# EAGLE design Temp Sensor - Photon Board (EAGLE 7.3.0)
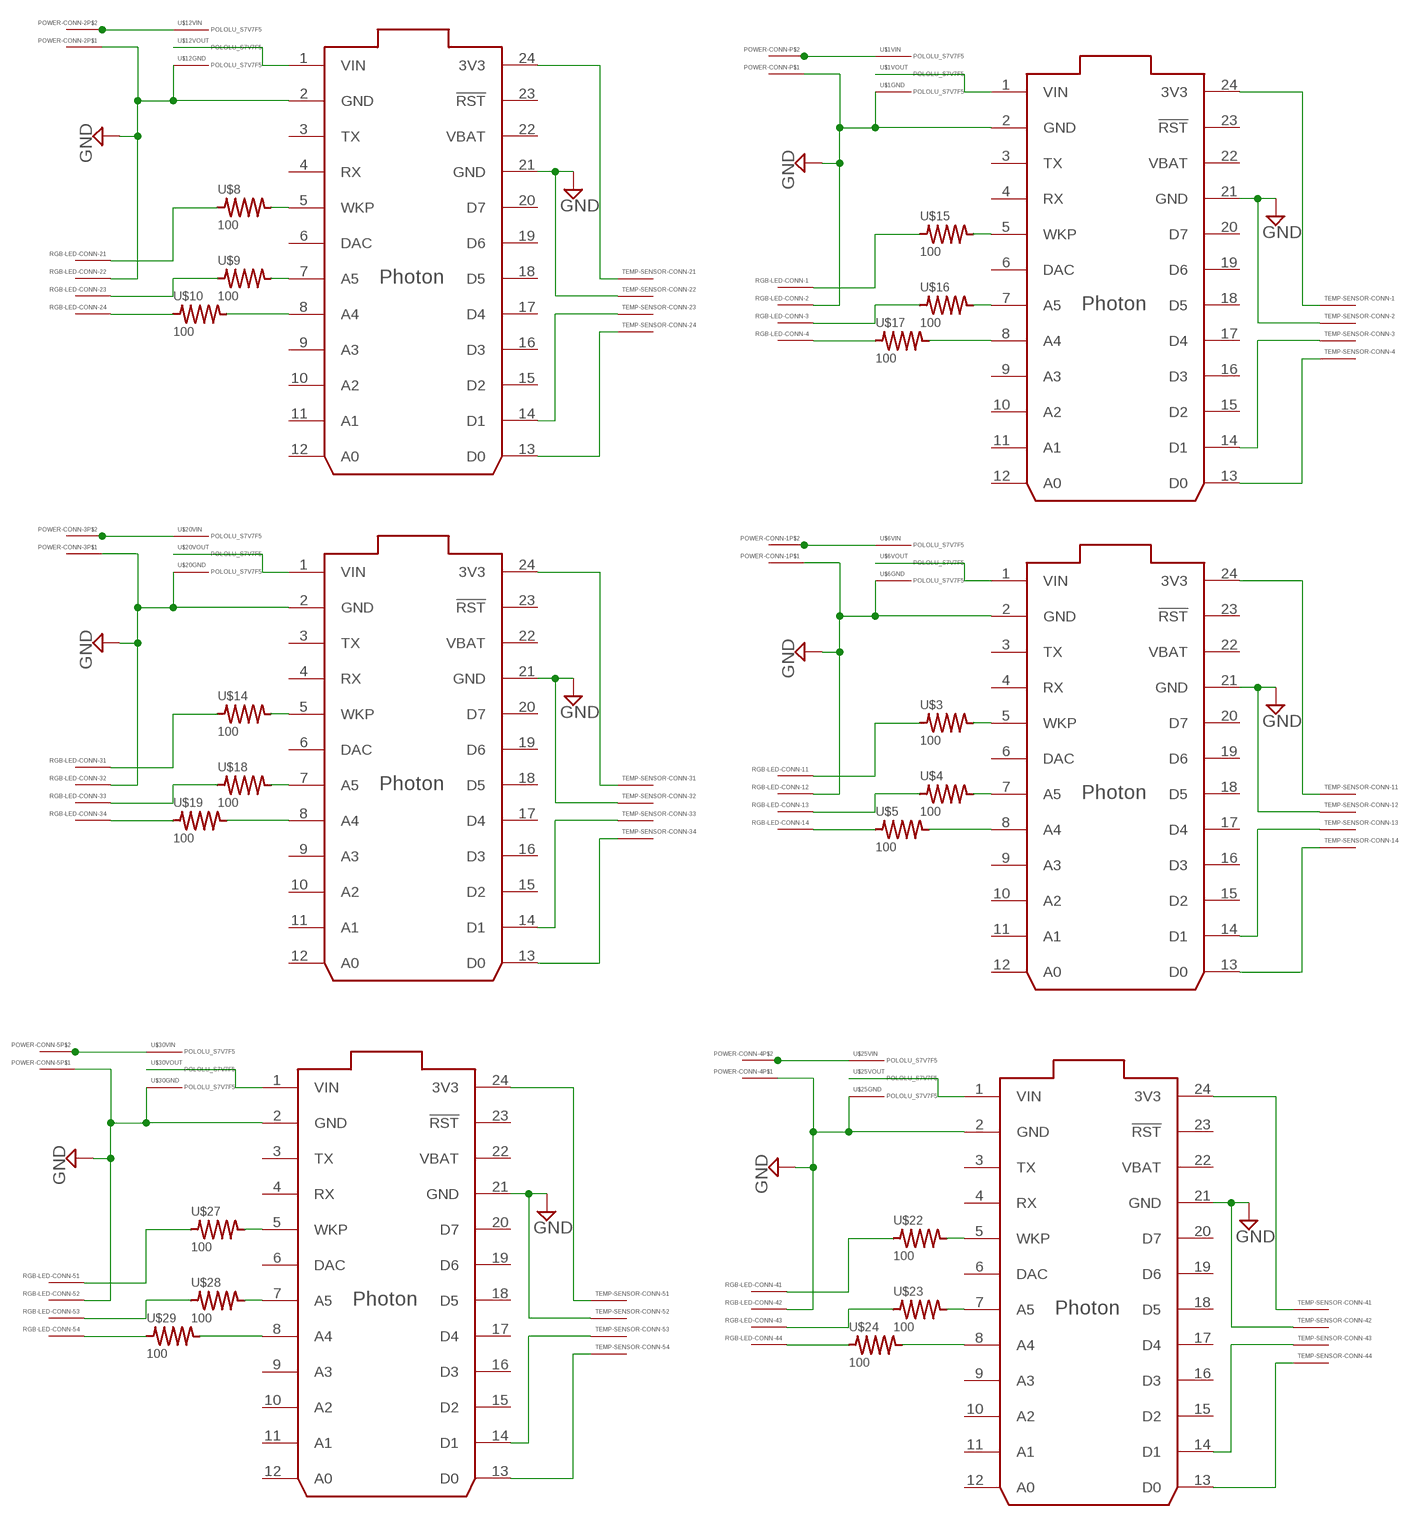
[diagram p0: schematic, sheet 1]

## Parts
POWER-CONN-  S2B-PH-K-S  [JST_PH-2]
POWER-CONN-1  S2B-PH-K-S  [JST_PH-2]
POWER-CONN-2  S2B-PH-K-S  [JST_PH-2]
POWER-CONN-3  S2B-PH-K-S  [JST_PH-2]
POWER-CONN-4  S2B-PH-K-S  [JST_PH-2]
POWER-CONN-5  S2B-PH-K-S  [JST_PH-2]
RGB-LED-CONN-  S4B-PH-K-S  [JST_PH-4]
RGB-LED-CONN-1  S4B-PH-K-S  [JST_PH-4]
RGB-LED-CONN-2  S4B-PH-K-S  [JST_PH-4]
RGB-LED-CONN-3  S4B-PH-K-S  [JST_PH-4]
RGB-LED-CONN-4  S4B-PH-K-S  [JST_PH-4]
RGB-LED-CONN-5  S4B-PH-K-S  [JST_PH-4]
TEMP-SENSOR-CONN-  S4B-PH-K-S  [JST_PH-4]
TEMP-SENSOR-CONN-1  S4B-PH-K-S  [JST_PH-4]
TEMP-SENSOR-CONN-2  S4B-PH-K-S  [JST_PH-4]
TEMP-SENSOR-CONN-3  S4B-PH-K-S  [JST_PH-4]
TEMP-SENSOR-CONN-4  S4B-PH-K-S  [JST_PH-4]
TEMP-SENSOR-CONN-5  S4B-PH-K-S  [JST_PH-4]
U$1  POLOLU_S7V7F5  [S7V7F5]
U$2  Photon w/ Headers  PHOTON_WITH_HEADERS  [PHOTON]
U$3  100  R0805  [R0805]
U$4  100  R0805  [R0805]
U$5  100  R0805  [R0805]
U$6  POLOLU_S7V7F5  [S7V7F5]
U$7  Photon w/ Headers  PHOTON_WITH_HEADERS  [PHOTON]
U$8  100  R0805  [R0805]
U$9  100  R0805  [R0805]
U$10  100  R0805  [R0805]
U$11  Photon w/ Headers  PHOTON_WITH_HEADERS  [PHOTON]
U$12  POLOLU_S7V7F5  [S7V7F5]
U$13  Photon w/ Headers  PHOTON_WITH_HEADERS  [PHOTON]
U$14  100  R0805  [R0805]
U$15  100  R0805  [R0805]
U$16  100  R0805  [R0805]
U$17  100  R0805  [R0805]
U$18  100  R0805  [R0805]
U$19  100  R0805  [R0805]
U$20  POLOLU_S7V7F5  [S7V7F5]
U$21  Photon w/ Headers  PHOTON_WITH_HEADERS  [PHOTON]
U$22  100  R0805  [R0805]
U$23  100  R0805  [R0805]
U$24  100  R0805  [R0805]
U$25  POLOLU_S7V7F5  [S7V7F5]
U$26  Photon w/ Headers  PHOTON_WITH_HEADERS  [PHOTON]
U$27  100  R0805  [R0805]
U$28  100  R0805  [R0805]
U$29  100  R0805  [R0805]
U$30  POLOLU_S7V7F5  [S7V7F5]

## Nets
GND: POWER-CONN-1.P$1 POWER-CONN-2.P$1 POWER-CONN-3.P$1 POWER-CONN-4.P$1 POWER-CONN-5.P$1 POWER-CONN-.P$1 RGB-LED-CONN-1.P$2 RGB-LED-CONN-2.P$2 RGB-LED-CONN-3.P$2 RGB-LED-CONN-4.P$2 RGB-LED-CONN-5.P$2 RGB-LED-CONN-.P$2 TEMP-SENSOR-CONN-1.P$2 TEMP-SENSOR-CONN-2.P$2 TEMP-SENSOR-CONN-3.P$2 TEMP-SENSOR-CONN-4.P$2 TEMP-SENSOR-CONN-5.P$2 TEMP-SENSOR-CONN-.P$2 U$1.GND U$2.2(GND) U$2.21(GND) U$6.GND U$7.2(GND) U$7.21(GND) U$11.2(GND) U$11.21(GND) U$12.GND U$13.2(GND) U$13.21(GND) U$20.GND U$21.2(GND) U$21.21(GND) U$25.GND U$26.2(GND) U$26.21(GND) U$30.GND
N$1: U$11.5(WKP) U$15.2
N$2: RGB-LED-CONN-.P$3 U$16.1
N$3: RGB-LED-CONN-.P$4 U$17.1
N$4: U$1.VOUT U$11.1(VIN)
N$5: POWER-CONN-.P$2 U$1.VIN
N$6: RGB-LED-CONN-1.P$3 U$4.1
N$7: TEMP-SENSOR-CONN-.P$1 U$11.24(3V3)
N$8: TEMP-SENSOR-CONN-.P$3 U$11.14(D1)
N$9: TEMP-SENSOR-CONN-.P$4 U$11.13(D0)
N$10: RGB-LED-CONN-1.P$4 U$5.1
N$11: U$11.7(A5) U$16.2
N$12: U$11.8(A4) U$17.2
N$13: RGB-LED-CONN-.P$1 U$15.1
N$14: TEMP-SENSOR-CONN-1.P$1 U$2.24(3V3)
N$15: TEMP-SENSOR-CONN-1.P$3 U$2.14(D1)
N$16: TEMP-SENSOR-CONN-1.P$4 U$2.13(D0)
N$17: U$2.5(WKP) U$3.2
N$18: U$2.7(A5) U$4.2
N$19: U$2.8(A4) U$5.2
N$20: RGB-LED-CONN-1.P$1 U$3.1
N$21: U$2.1(VIN) U$6.VOUT
N$22: POWER-CONN-1.P$2 U$6.VIN
N$23: RGB-LED-CONN-2.P$3 U$9.1
N$24: RGB-LED-CONN-2.P$4 U$10.1
N$25: TEMP-SENSOR-CONN-2.P$1 U$7.24(3V3)
N$26: TEMP-SENSOR-CONN-2.P$3 U$7.14(D1)
N$27: TEMP-SENSOR-CONN-2.P$4 U$7.13(D0)
N$28: U$7.5(WKP) U$8.2
N$29: U$7.7(A5) U$9.2
N$30: U$7.8(A4) U$10.2
N$31: RGB-LED-CONN-2.P$1 U$8.1
N$32: U$7.1(VIN) U$12.VOUT
N$33: POWER-CONN-2.P$2 U$12.VIN
N$34: RGB-LED-CONN-3.P$3 U$18.1
N$35: RGB-LED-CONN-3.P$4 U$19.1
N$36: TEMP-SENSOR-CONN-3.P$1 U$13.24(3V3)
N$37: TEMP-SENSOR-CONN-3.P$3 U$13.14(D1)
N$38: TEMP-SENSOR-CONN-3.P$4 U$13.13(D0)
N$39: U$13.5(WKP) U$14.2
N$40: U$13.7(A5) U$18.2
N$41: U$13.8(A4) U$19.2
N$42: RGB-LED-CONN-3.P$1 U$14.1
N$43: U$13.1(VIN) U$20.VOUT
N$44: POWER-CONN-3.P$2 U$20.VIN
N$45: RGB-LED-CONN-4.P$3 U$23.1
N$46: RGB-LED-CONN-4.P$4 U$24.1
N$47: TEMP-SENSOR-CONN-4.P$1 U$21.24(3V3)
N$48: TEMP-SENSOR-CONN-4.P$3 U$21.14(D1)
N$49: TEMP-SENSOR-CONN-4.P$4 U$21.13(D0)
N$50: U$21.5(WKP) U$22.2
N$51: U$21.7(A5) U$23.2
N$52: U$21.8(A4) U$24.2
N$53: RGB-LED-CONN-4.P$1 U$22.1
N$54: U$21.1(VIN) U$25.VOUT
N$55: POWER-CONN-4.P$2 U$25.VIN
N$56: RGB-LED-CONN-5.P$3 U$28.1
N$57: RGB-LED-CONN-5.P$4 U$29.1
N$58: TEMP-SENSOR-CONN-5.P$1 U$26.24(3V3)
N$59: TEMP-SENSOR-CONN-5.P$3 U$26.14(D1)
N$60: TEMP-SENSOR-CONN-5.P$4 U$26.13(D0)
N$61: U$26.5(WKP) U$27.2
N$62: U$26.7(A5) U$28.2
N$63: U$26.8(A4) U$29.2
N$64: RGB-LED-CONN-5.P$1 U$27.1
N$65: U$26.1(VIN) U$30.VOUT
N$66: POWER-CONN-5.P$2 U$30.VIN
Unconnected: U$2.3(TX) U$2.4(RX) U$2.6(DAC) U$2.9(A3) U$2.10(A2) U$2.11(A1) U$2.12(A0) U$2.15(D2) U$2.16(D3) U$2.17(D4) U$2.18(D5) U$2.19(D6) U$2.20(D7) U$2.23(!RST) U$7.3(TX) U$7.4(RX) U$7.6(DAC) U$7.9(A3) U$7.10(A2) U$7.11(A1) U$7.12(A0) U$7.15(D2) U$7.16(D3) U$7.17(D4) U$7.18(D5) U$7.19(D6) U$7.20(D7) U$7.23(!RST) U$11.3(TX) U$11.4(RX) U$11.6(DAC) U$11.9(A3) U$11.10(A2) U$11.11(A1) U$11.12(A0) U$11.15(D2) U$11.16(D3) U$11.17(D4) U$11.18(D5) U$11.19(D6) U$11.20(D7) U$11.23(!RST) U$13.3(TX) U$13.4(RX) U$13.6(DAC) U$13.9(A3) U$13.10(A2) U$13.11(A1) U$13.12(A0) U$13.15(D2) U$13.16(D3) U$13.17(D4) U$13.18(D5) U$13.19(D6) U$13.20(D7) U$13.23(!RST) U$21.3(TX) U$21.4(RX) U$21.6(DAC) U$21.9(A3) U$21.10(A2) U$21.11(A1) U$21.12(A0) U$21.15(D2) U$21.16(D3) U$21.17(D4) U$21.18(D5) U$21.19(D6) U$21.20(D7) U$21.23(!RST) U$26.3(TX) U$26.4(RX) U$26.6(DAC) U$26.9(A3) U$26.10(A2) U$26.11(A1) U$26.12(A0) U$26.15(D2) U$26.16(D3) U$26.17(D4) U$26.18(D5) U$26.19(D6) U$26.20(D7) U$26.23(!RST)

## Power pins joined to a net without a drawn wire
VBAT: U$2.22(VBAT) U$7.22(VBAT) U$11.22(VBAT) U$13.22(VBAT) U$21.22(VBAT) U$26.22(VBAT)

## Library data of the parts
POWER-CONN- POWER-CONN-1-POWER-CONN-5 = myhvac:S2B-PH-K-S: 2 Pin JST PH series right angle female connector. The PH series side entry, through hole shrouded header from JST are 2.0mm pitch, single row wire to board disconnect crimp style connectors
RGB-LED-CONN- RGB-LED-CONN-1-RGB-LED-CONN-5 TEMP-SENSOR-CONN- TEMP-SENSOR-CONN-1-TEMP-SENSOR-CONN-5 = myhvac:S4B-PH-K-S: 4 Pin JST PH series right angle female connector. The PH series side entry, through hole shrouded header from JST are 2.0mm pitch, single row wire to board disconnect crimp style connectors
U$1 U$6 U$12 U$20 U$25 U$30 = myhvac:POLOLU_S7V7F5: Pololu S7V7F5 5V Step-Up/Step-Down Voltage Regulator The S7V7F5 switching step-up/step-down regulator efficiently produces 5 V from input voltages between 2.7 V and 11.8 V. Its ability to convert both higher and lower input voltages makes it useful for applications where the power supply voltage can vary greatly, as with batteries that start above but discharge below 5 V. The very compact (0.35″ × 0.475″) module has a typical efficiency of over 90% and can supply up to 1 A when stepping down and about 500 mA when stepping up. https://www.pololu.com/product/2119/
U$2 U$7 U$11 U$13 U$21 U$26 = Spark:PHOTON
U$3-U$5 U$8-U$10 U$14-U$19 U$22-U$24 U$27-U$29 = myhvac:R0805

## Board
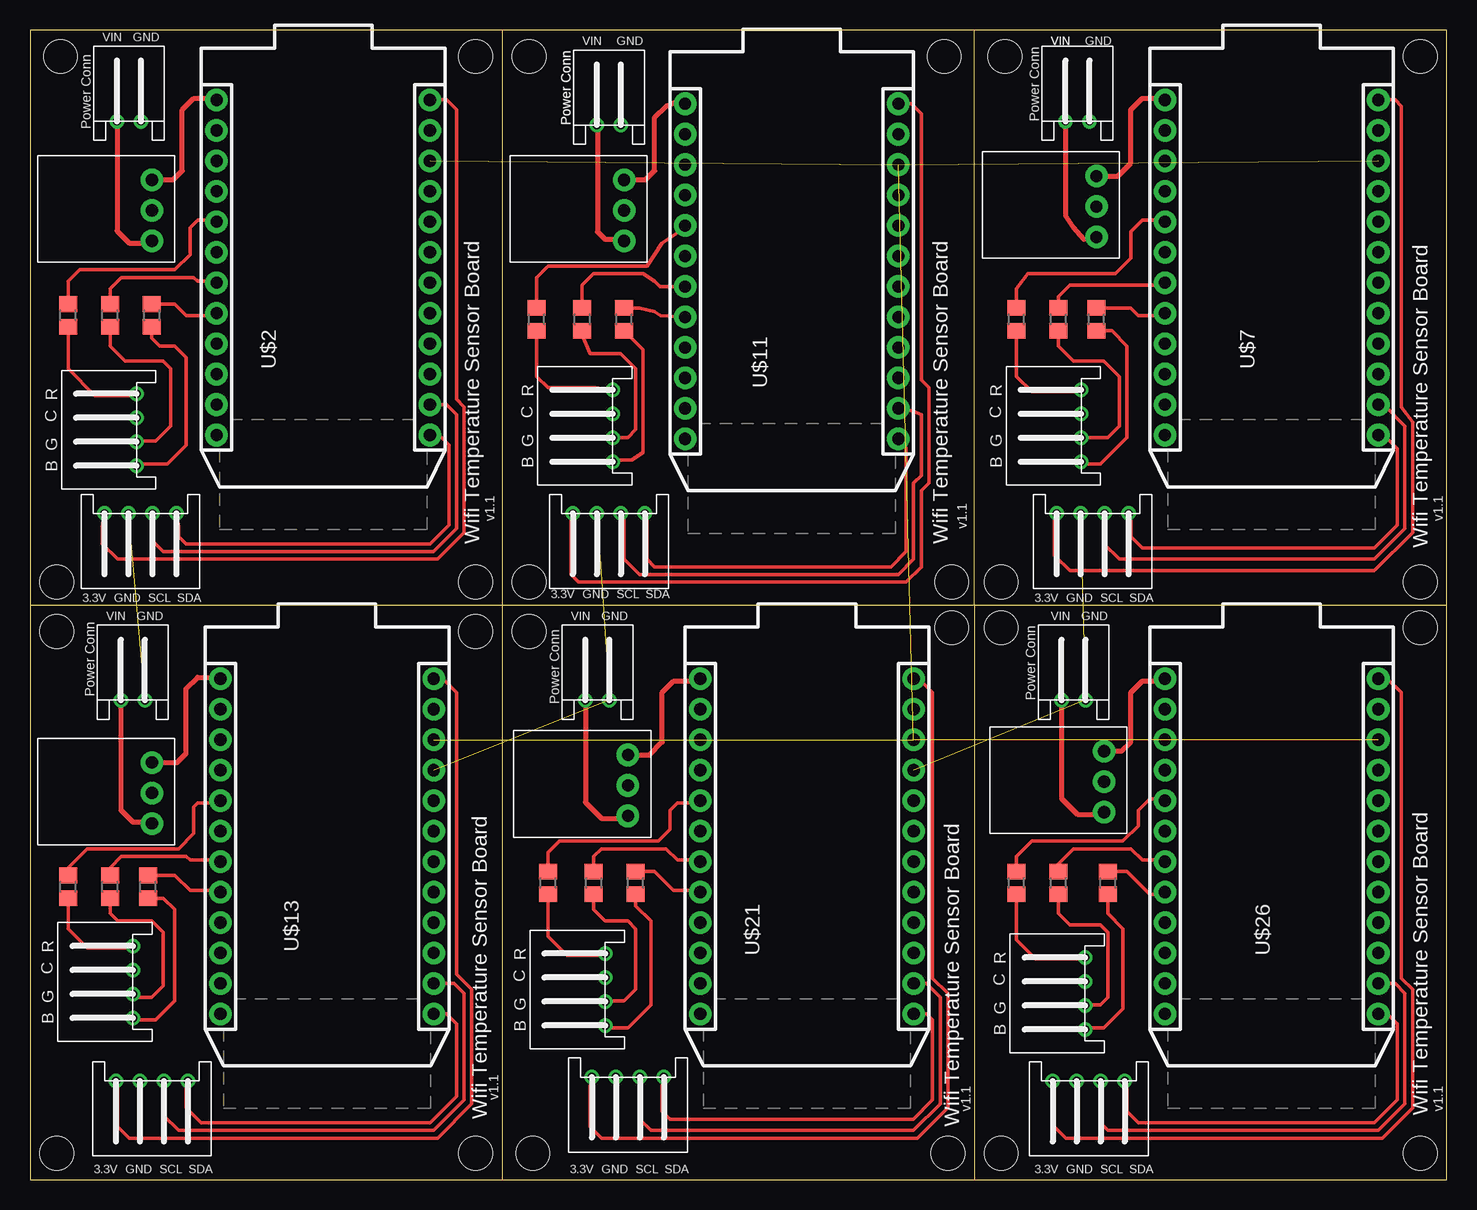
[diagram p1: board, top side]
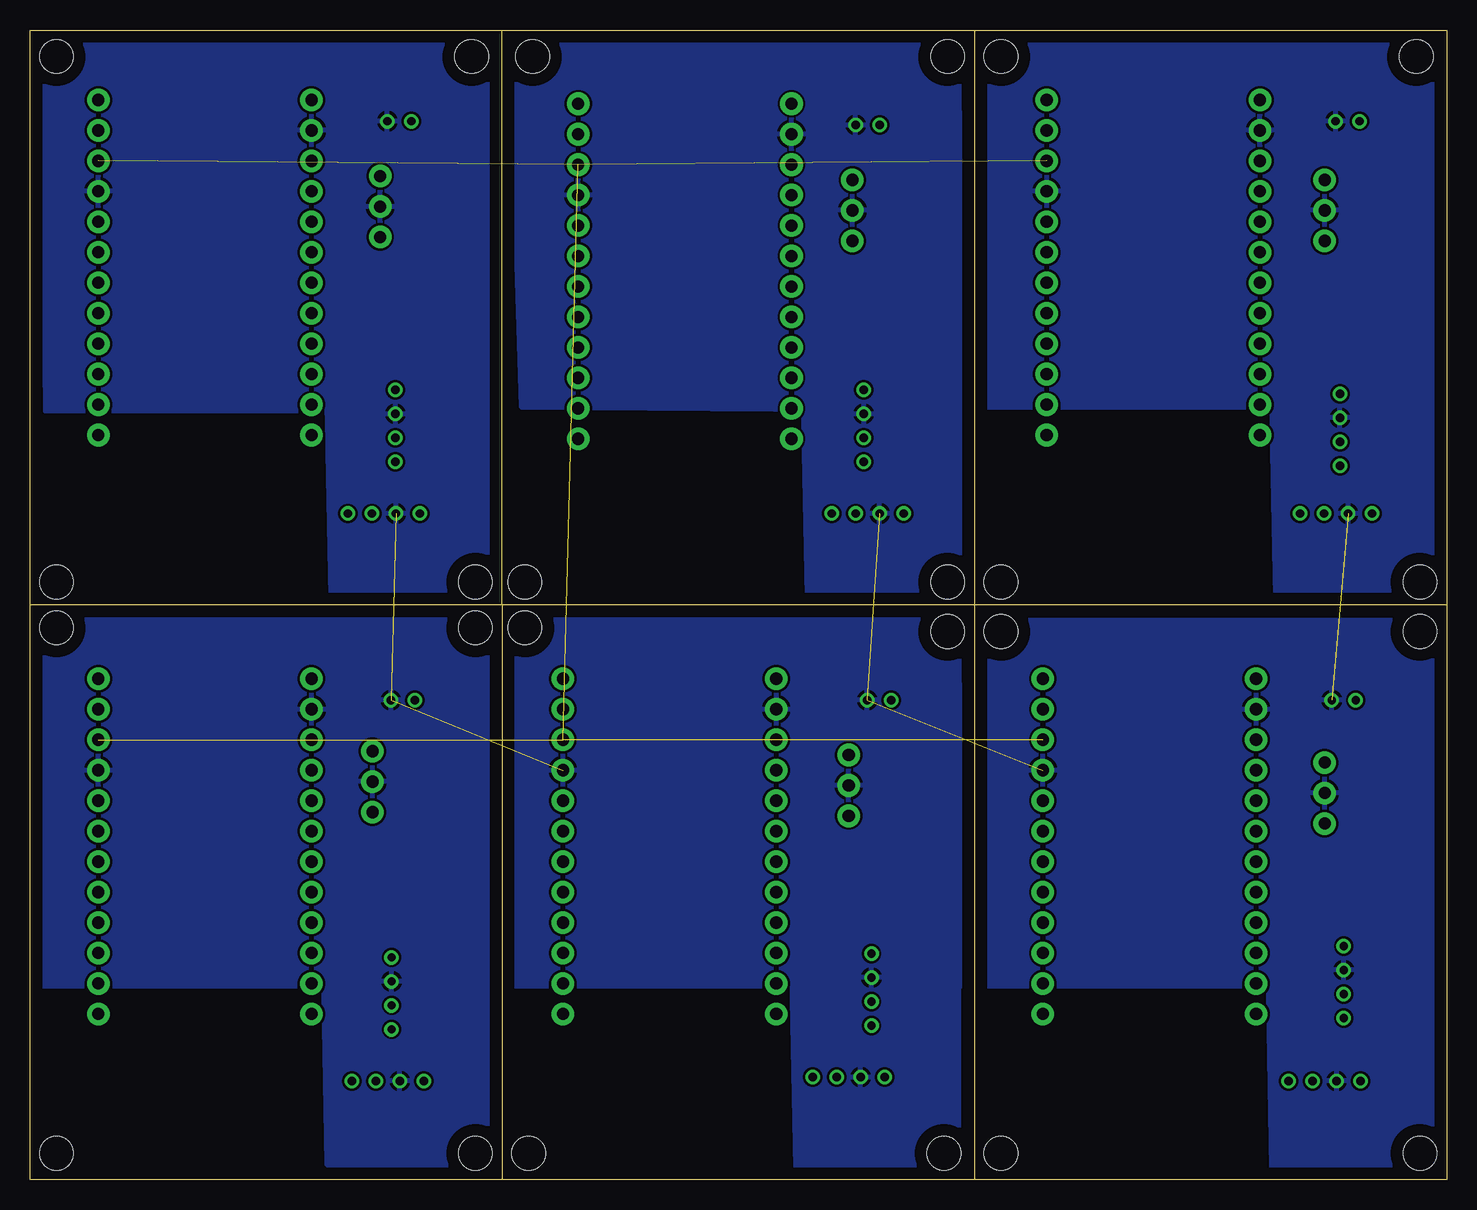
[diagram p2: board, bottom side, seen from below]

Size 118.09 x 95.87 mm. Coordinates in mm from the lower left corner, seen from the top.
Outline: 78.74,95.87 118.09,95.87 118.09,47.94 78.74,47.94
Outline: 39.35,95.87 0,95.87 0,47.94 39.35,47.94
Outline: 118.09,47.93 118.09,0 78.74,0 78.74,47.93
Outline: 78.72,0 39.37,0 39.37,47.93
Outline: 39.35,0 0,0 0,47.93
Outline: 39.37,47.94 78.72,47.94 78.72,95.87 39.37,95.87 39.37,47.94
Copper layers (1*16): Top 0.035mm / dielectric 1.5mm / Bottom 0.035mm
Design rules "default": minimum track width 10mil, minimum drill 24mil, track to track 8mil, track to pad 8mil, pad to pad 8mil, via to via 8mil, smd to smd 8mil, copper to edge 40mil, drill to drill 8mil, minimum pad ring 10mil, minimum via ring 8mil, stop-mask expansion 4mil, vias tented up to drill 0mil, thermal gap 10mil
Holes 2.8 mm at 41.59,93.66 76.2,93.66 76.84,49.85 41.59,49.85 2.54,93.66 37.15,93.66 37.15,49.85 2.22,49.85 2.22,45.72 37.15,45.72 37.15,2.22 2.22,2.22 81.28,93.66 115.89,93.66 115.89,49.85 80.96,49.85 80.96,46.04 115.89,46.04 115.89,2.22 80.96,2.22 41.59,45.72 76.84,46.04 76.52,2.22 41.91,2.22

### Footprints (pad centres in the part's own frame; a part is rotated, then mirrored left to right if it is on the bottom)
JST_PH-2 = drill 0.7: P$1 -1,0; P$2 1,0
JST_PH-4 = drill 0.7: P$1 -3,0; P$2 -1,0; P$3 1,0; P$4 3,0
S7V7F5 = drill 1.016 pad 1.88: GND 0.635,-0.127; VIN 0.635,-2.667; VOUT 0.635,2.413
PHOTON = drill 1.016 pad 1.88: 1 1.27,32.258; 2 1.27,29.718; 3 1.27,27.178; 4 1.27,24.638; 5 1.27,22.098; 6 1.27,19.558; 7 1.27,17.018; 8 1.27,14.478; 9 1.27,11.938; 10 1.27,9.398; 11 1.27,6.858; 12 1.27,4.318; 13 19.05,4.318; 14 19.05,6.858; 15 19.05,9.398; 16 19.05,11.938; 17 19.05,14.478; 18 19.05,17.018; 19 19.05,19.558; 20 19.05,22.098; 21 19.05,24.638; 22 19.05,27.178; 23 19.05,29.718; 24 19.05,32.258
R0805 = smd 1.3 x 1.5: 1 -0.95,0; 2 0.95,0

### Placement (x,y rotation side)
POWER-CONN-  48.26,87.95 180 top
POWER-CONN-1  8.26,88.27 180 top
POWER-CONN-2  87.31,88.27 180 top
POWER-CONN-3  8.57,40.01 180 top
POWER-CONN-4  47.31,40.01 180 top
POWER-CONN-5  87,40.01 180 top
RGB-LED-CONN-  48.58,62.87 270 top
RGB-LED-CONN-1  8.89,62.55 270 top
RGB-LED-CONN-2  87.63,62.87 270 top
RGB-LED-CONN-3  8.57,16.51 270 top
RGB-LED-CONN-4  47.94,15.88 270 top
RGB-LED-CONN-5  87.95,15.56 270 top
TEMP-SENSOR-CONN-  48.26,55.56 0 top
TEMP-SENSOR-CONN-1  9.21,55.56 0 top
TEMP-SENSOR-CONN-2  88.58,55.56 0 top
TEMP-SENSOR-CONN-3  10.16,8.26 0 top
TEMP-SENSOR-CONN-4  49.85,8.57 0 top
TEMP-SENSOR-CONN-5  88.27,8.26 0 top
U$1  48.9,80.96 0 top
U$2  14.29,57.79 0 top
U$3  3.18,72.07 90 top
U$4  6.67,72.07 90 top
U$5  10.16,72.07 90 top
U$6  9.52,80.96 0 top
U$7  93.34,57.79 0 top
U$8  82.23,71.75 90 top
U$9  85.72,71.75 90 top
U$10  88.9,71.75 90 top
U$11  53.34,57.47 0 top
U$12  88.27,81.28 0 top
U$13  14.61,9.53 0 top
U$14  3.18,24.45 90 top
U$15  42.23,71.75 90 top
U$16  46.04,71.75 90 top
U$17  49.53,71.75 90 top
U$18  6.67,24.45 90 top
U$19  9.84,24.45 90 top
U$20  9.52,32.39 0 top
U$21  54.61,9.53 0 top
U$22  43.18,24.77 90 top
U$23  46.99,24.77 90 top
U$24  50.48,24.77 90 top
U$25  49.21,33.02 0 top
U$26  93.34,9.53 0 top
U$27  82.23,24.77 90 top
U$28  85.72,24.77 90 top
U$29  89.85,24.77 90 top
U$30  88.9,33.34 0 top

### Tracks (layer width: path | path; a pad name or v marks a point on that pad's centre or on a via)
GND  (5 unrouted)
  pour Bottom: 40.64,94.93 78.11,94.93 77.15,64.45 40.32,64.14
  pour Bottom: 0.95,94.93 38.42,94.93 38.42,64.45 0.95,64.45
  pour Bottom: 79.69,94.93 117.16,94.93 116.84,64.14 79.38,64.14
  pour Bottom: 79.69,47.31 117.16,47.31 117.16,16.19 79.69,16.19
  pour Bottom: 40.64,47.31 78.11,47.31 77.79,16.19 40.32,16.19
  pour Bottom: 0.95,46.99 38.42,46.99 38.42,16.19 0.95,16.19
  pour Bottom: 0.64,64.45 14.61,64.77 14.29,48.58 0.64,48.26
  pour Bottom: 0.95,16.83 14.92,17.15 14.61,0.95 0.95,0.64
  pour Bottom: 40.64,16.83 54.61,17.15 54.29,0.95 40.64,0.64
  pour Bottom: 79.69,17.15 93.66,17.46 93.34,1.27 79.69,0.95
  pour Bottom: 79.38,64.45 93.34,64.77 93.03,48.58 79.38,48.26
  pour Bottom: 40.32,64.77 53.66,64.77 53.34,48.58 40.32,48.58
N$1
  Top 0.305: U$15.2 42.23,75.25 43.18,76.2 51.44,76.2 52.7,78.11 54.1,79.06 U$11.5
N$2
  Top 0.305: U$16.1 46.04,70.49 46.67,68.9 49.21,68.9 50.48,67.63 50.48,62.55 49.85,61.91 49.26,61.91 RGB-LED-CONN-.P$3
N$3
  Top 0.305: U$17.1 49.85,70.49 51.12,69.22 51.12,60.64 50.16,60.01 48.75,60.01 RGB-LED-CONN-.P$4
N$4
  Top 0.406: U$1.VOUT 51.31,83.38 52.07,84.14 52.07,88.58 53.02,89.54 53.78,89.85 U$11.1
N$5
  Top 0.406: POWER-CONN-.P$2 47.31,87.95 47.31,79.06 47.94,78.42 49.4,78.42 U$1.VIN
N$6
  Top 0.305: U$4.1 6.67,69.53 7.94,68.26 11.11,68.26 11.75,67.63 11.75,62.86 10.48,61.59 8.94,61.59 RGB-LED-CONN-1.P$3
N$7
  Top 0.305: U$11.24 73.47,89.73 74.3,88.9 74.3,66.68 74.93,66.04 74.93,58.1 74.3,57.47 74.3,51.12 73.03,49.85 45.72,49.85 45.09,50.48 45.09,55.39 TEMP-SENSOR-CONN-.P$1
N$8
  Top 0.305: TEMP-SENSOR-CONN-.P$3 49.53,55.29 49.53,51.75 50.8,50.48 72.39,50.48 73.66,51.75 73.66,58.1 74.3,58.74 74.3,63.82 73.47,64.13 U$11.14
N$9
  Top 0.305: U$11.13 72.84,61.47 73.03,60.96 73.03,52.39 71.75,51.12 52.07,51.12 51.44,51.75 51.44,55.39 TEMP-SENSOR-CONN-.P$4
N$10
  Top 0.305: U$5.1 10.16,70.17 10.8,69.53 12.07,69.53 13.02,68.58 13.02,61.28 11.43,59.69 9.03,59.69 RGB-LED-CONN-1.P$4
N$11
  Top 0.305: U$11.7 52.52,74.49 52.07,74.93 51.12,75.56 46.99,75.56 46.04,74.61 U$16.2
N$12
  Top 0.305: U$17.2 50.8,72.7 52.07,72.39 52.58,72.07 U$11.8
N$13
  Top 0.305: U$15.1 42.23,66.99 43.18,66.04 47.16,66.04 RGB-LED-CONN-.P$1
N$14
  Top 0.305: U$2.24 34.73,90.04 35.56,89.22 35.56,65.09 36.2,64.45 36.2,53.97 33.97,51.75 7.3,51.75 6.03,53.02 6.03,54.43 TEMP-SENSOR-CONN-1.P$1
N$15
  Top 0.305: U$2.14 34.73,64.64 35.56,63.82 35.56,54.29 33.66,52.39 11.11,52.39 10.16,53.34 10.16,54.56 TEMP-SENSOR-CONN-1.P$3
N$16
  Top 0.305: U$2.13 34.1,62.1 34.92,61.28 34.92,54.61 33.34,53.02 13.02,53.02 12.38,53.66 12.38,54.43 TEMP-SENSOR-CONN-1.P$4
N$17
  Top 0.305: U$3.2 3.18,74.93 4.13,75.88 12.07,75.88 13.34,77.15 13.34,79.38 13.97,80.01 15.43,80.01 U$2.5
N$18
  Top 0.305: U$4.2 6.67,74.29 7.62,75.25 13.65,75.25 13.97,74.93 15.43,74.93 U$2.7
N$19
  Top 0.305: U$5.2 12.07,73.02 13.02,72.07 15.37,72.07 U$2.8
N$20
  Top 0.305: U$3.1 3.18,67.63 5.4,65.4 8.75,65.4 RGB-LED-CONN-1.P$1
N$21
  Top 0.406: U$6.VOUT 11.94,83.38 12.7,84.14 12.7,89.22 13.65,90.17 15.43,90.17 U$2.1
N$22
  Top 0.406: POWER-CONN-1.P$2 7.26,79.11 8.26,78.11 9.97,78.11 U$6.VIN
N$23
  Top 0.305: U$9.1 85.72,69.53 87,68.26 89.53,68.26 90.81,66.99 90.81,62.86 89.85,61.91 87.68,61.91 RGB-LED-CONN-2.P$3
N$24
  Top 0.305: U$10.1 90.17,70.81 91.44,69.53 91.44,61.91 89.22,59.69 87.81,59.69 RGB-LED-CONN-2.P$4
N$25
  Top 0.305: U$7.24 113.79,90.04 114.3,89.54 114.3,64.45 115.25,63.18 115.25,53.97 112.08,50.8 86.68,50.8 85.41,52.07 85.41,55.39 TEMP-SENSOR-CONN-2.P$1
N$26
  Top 0.305: U$7.14 112.84,64.64 114.62,62.86 114.62,54.29 112.08,51.75 90.81,51.75 89.53,53.02 89.53,55.51 TEMP-SENSOR-CONN-2.P$3
N$27
  Top 0.305: U$7.13 112.84,62.1 113.98,60.96 113.98,54.61 112.08,52.71 92.71,52.71 91.76,53.66 91.76,55.39 TEMP-SENSOR-CONN-2.P$4
N$28
  Top 0.305: U$8.2 82.23,74.29 83.19,75.56 90.49,75.56 91.76,76.83 91.76,79.06 92.71,80.01 94.49,80.01 U$7.5
N$29
  Top 0.305: U$9.2 85.72,73.66 86.68,74.61 94.43,74.61 U$7.7
N$30
  Top 0.305: U$10.2 91.76,72.7 92.39,72.07 94.43,72.07 U$7.8
N$31
  Top 0.305: U$8.1 82.23,66.99 83.5,65.72 87.49,65.72 RGB-LED-CONN-2.P$1
N$32
  Top 0.406: U$12.VOUT 90.68,83.69 91.76,84.77 91.76,89.22 92.71,90.17 94.49,90.17 U$7.1
N$33
  Top 0.406: POWER-CONN-2.P$2 86.31,80.37 87,79.38 87.82,78.42 U$12.VIN
N$34
  Top 0.305: U$18.1 6.67,22.22 7.3,21.59 10.16,21.59 11.11,20.64 11.11,16.19 10.16,15.24 8.84,15.24 RGB-LED-CONN-3.P$3
N$35
  Top 0.305: U$19.1 11.11,23.5 12.07,22.54 12.07,14.92 10.48,13.33 8.75,13.33 RGB-LED-CONN-3.P$4
N$36
  Top 0.305: U$13.24 34.42,41.78 35.56,40.64 35.56,17.15 36.83,15.87 36.83,6.35 33.97,3.49 8.26,3.49 7.3,4.44 7.3,8.11 TEMP-SENSOR-CONN-3.P$1
N$37
  Top 0.305: U$13.14 35.37,16.38 36.2,15.56 36.2,6.67 33.66,4.13 12.38,4.13 11.11,5.4 11.11,8.21 TEMP-SENSOR-CONN-3.P$3
N$38
  Top 0.305: U$13.13 34.73,13.84 35.56,13.02 35.56,6.98 33.34,4.76 14.29,4.76 13.02,6.03 13.02,8.11 TEMP-SENSOR-CONN-3.P$4
N$39
  Top 0.305: U$14.2 3.18,26.04 4.76,27.62 12.38,27.62 13.65,28.89 13.65,31.11 13.97,31.43 15.68,31.43 U$13.5
N$40
  Top 0.305: U$18.2 6.67,26.04 7.62,26.99 13.02,26.99 13.34,26.67 15.75,26.67 U$13.7
N$41
  Top 0.305: U$19.2 12.07,25.4 13.34,24.13 15.75,24.13 U$13.8
N$42
  Top 0.305: U$14.1 3.18,20.95 4.76,19.37 8.43,19.37 RGB-LED-CONN-3.P$1
N$43
  Top 0.406: U$20.VOUT 12.26,34.8 13.02,35.56 13.02,40.96 13.97,41.91 15.75,41.91 U$13.1
N$44
  Top 0.406: POWER-CONN-3.P$2 7.57,30.84 8.57,29.84 10.03,29.84 U$20.VIN
N$45
  Top 0.305: U$23.1 46.99,22.54 47.94,21.59 49.85,21.59 50.48,20.95 50.48,15.87 49.53,14.92 47.99,14.92 RGB-LED-CONN-4.P$3
N$46
  Top 0.305: U$24.1 50.48,22.86 51.75,21.59 51.75,14.61 49.85,12.7 48.12,12.7 RGB-LED-CONN-4.P$4
N$47
  Top 0.305: U$21.24 74.1,41.78 75.25,40.64 75.25,16.83 76.52,15.56 76.52,6.03 73.98,3.49 47.62,3.49 46.67,4.44 46.67,7.76 TEMP-SENSOR-CONN-4.P$1
N$48
  Top 0.305: U$21.14 74.74,16.38 75.88,15.24 75.88,6.35 73.66,4.13 51.75,4.13 50.8,5.08 50.8,7.89 TEMP-SENSOR-CONN-4.P$3
N$49
  Top 0.305: U$21.13 74.74,13.84 75.25,13.33 75.25,6.67 73.66,5.08 53.34,5.08 52.7,5.72 52.7,7.79 TEMP-SENSOR-CONN-4.P$4
N$50
  Top 0.305: U$22.2 43.18,27.31 44.13,28.26 52.39,28.26 53.34,29.21 53.34,30.8 53.98,31.43 55.69,31.43 U$21.5
N$51
  Top 0.305: U$23.2 46.99,26.99 47.62,27.62 53.02,27.62 53.98,26.67 55.75,26.67 U$21.7
N$52
  Top 0.305: U$24.2 52.07,25.72 53.66,24.13 55.75,24.13 U$21.8
N$53
  Top 0.305: U$22.1 43.18,20.32 44.77,18.73 47.8,18.73 RGB-LED-CONN-4.P$1
N$54
  Top 0.406: U$25.VOUT 51.62,35.43 52.7,36.51 52.7,40.64 53.66,41.59 55.69,41.59 U$21.1
N$55
  Top 0.406: POWER-CONN-4.P$2 46.31,31.48 47.62,30.16 49.66,30.16 U$25.VIN
N$56
  Top 0.305: U$28.1 85.72,22.22 86.68,21.27 89.22,21.27 89.85,20.64 89.85,15.24 89.22,14.61 88,14.61 RGB-LED-CONN-5.P$3
N$57
  Top 0.305: U$29.1 89.85,22.22 91.12,20.95 91.12,14.29 89.53,12.7 88.09,12.7 RGB-LED-CONN-5.P$4
N$58
  Top 0.305: U$26.24 113.16,41.78 114.3,40.64 114.3,16.83 115.25,15.87 115.25,6.03 112.71,3.49 86.36,3.49 85.41,4.44 85.41,7.79 TEMP-SENSOR-CONN-5.P$1
N$59
  Top 0.305: U$26.14 113.79,16.38 114.62,15.56 114.62,6.35 112.4,4.13 89.85,4.13 89.22,4.76 89.22,7.89 TEMP-SENSOR-CONN-5.P$3
N$60
  Top 0.305: U$26.13 113.16,13.84 113.98,13.02 113.98,6.67 112.08,4.76 92.39,4.76 91.44,5.72 91.44,7.76 TEMP-SENSOR-CONN-5.P$4
N$61
  Top 0.305: U$27.2 82.23,26.99 83.5,28.26 91.12,28.26 92.39,29.53 92.39,30.8 93.34,31.75 94.49,31.75 U$26.5
N$62
  Top 0.305: U$28.2 85.72,26.35 87,27.62 91.76,27.62 92.71,26.67 94.49,26.67 U$26.7
N$63
  Top 0.305: U$29.2 91.44,25.72 93.34,23.81 94.43,23.81 U$26.8
N$64
  Top 0.305: U$27.1 82.23,20 83.82,18.42 87.81,18.42 RGB-LED-CONN-5.P$1
N$65
  Top 0.406: U$30.VOUT 91,35.75 91.76,36.51 91.76,40.64 92.71,41.59 94.43,41.59 U$26.1
N$66
  Top 0.406: POWER-CONN-5.P$2 86,31.8 87.31,30.48 89.34,30.48 U$30.VIN
VBAT  (5 unrouted)

### Text on the board
tNames: VIN | GND | VIN | GND | VIN | VIN | GND | Power Conn | Power Conn | Power Conn | Power Conn | R | R | R | C | C | C | G | G | G | B | B | B | v1.1 | v1.1 | v1.1 | Wifi Temperature Sensor Board | Wifi Temperature Sensor Board | Wifi Temperature Sensor Board | 3.3V | GND | SCL | SDA | 3.3V | GND | SCL | SDA | 3.3V | GND | SCL | SDA | VIN | GND | VIN | GND | VIN | GND | Power Conn | Power Conn | Power Conn | R | R | R | C | C | G | C | G | G | B | B | B | v1.1 | v1.1 | v1.1 | Wifi Temperature Sensor Board | Wifi Temperature Sensor Board | Wifi Temperature Sensor Board | 3.3V | GND | SCL | SDA | 3.3V | GND | SCL | SDA | 3.3V | GND | SCL | SDA